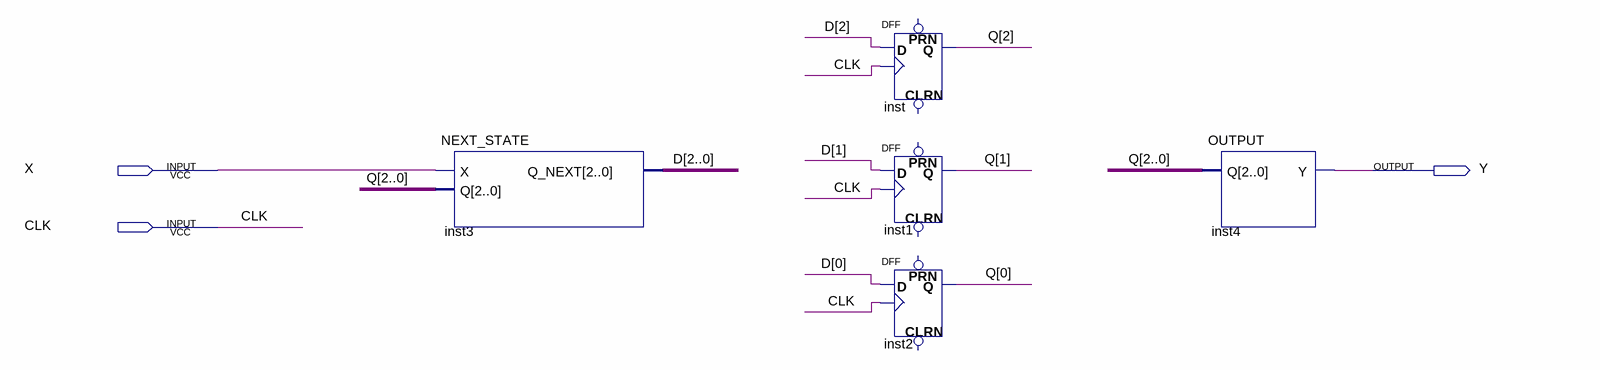
[diagram p0: schematic sheet]
// Quartus schematic LAST_NUM_Detection.bdf as structural Verilog: 5 symbols, 3 pins
module LAST_NUM_Detection (
  input  X,
  input  CLK,
  output Y
);

  wire [2:0] D, Q;

  NEXT_STATE inst3 (.X(X), .Q(Q), .Q_NEXT(D));
  DFF inst (.CLK(CLK), .D(D[2]), .Q(Q[2]));  // open: CLRN, PRN
  DFF inst1 (.CLK(CLK), .D(D[1]), .Q(Q[1]));  // open: CLRN, PRN
  DFF inst2 (.CLK(CLK), .D(D[0]), .Q(Q[0]));  // open: CLRN, PRN
  OUTPUT inst4 (.Q(Q), .Y(Y));
endmodule
